# Altium project SmartPower.PrjPcb (part 2 of 2)

## Sheet [4] USB-PD Controller.SchDoc: Type-C and Sink Controller
size A3; Author: Caner ALP; Organization: ALP Electronics; Address1: Axel Oxenstiernas; Address2: Västerås; Address3: 72478; Address4: Sweden; DocumentNumber: 4; Revision: P0.1; SheetNumber: 4; SheetTotal: 7
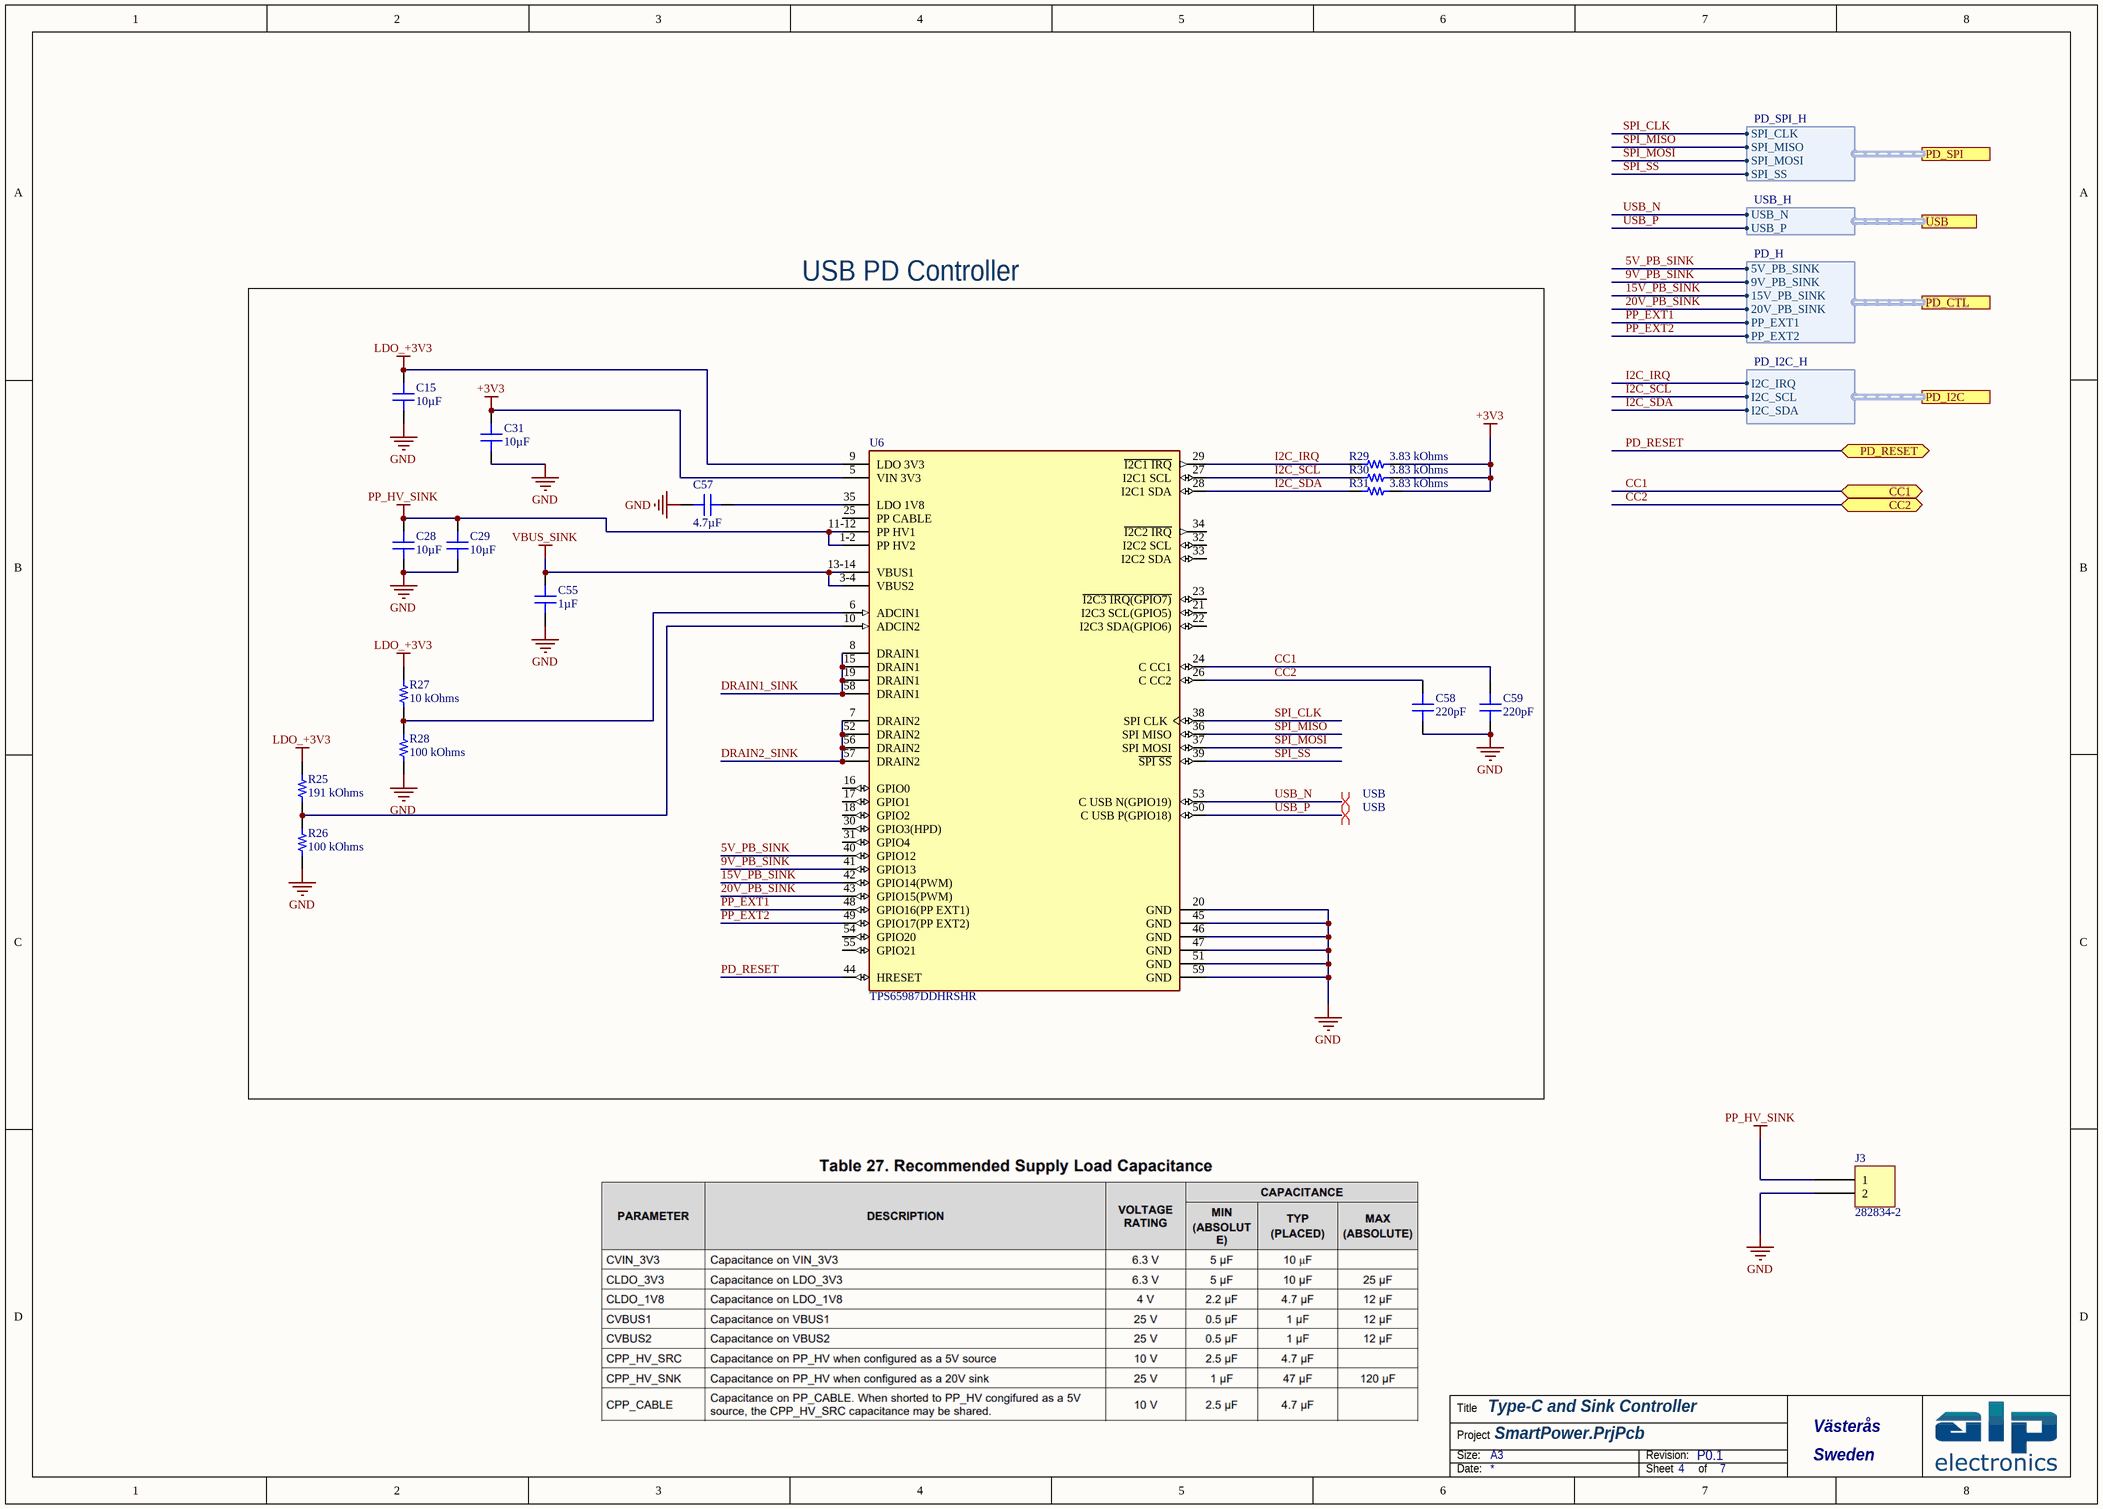
[diagram p4: [4] USB-PD Controller.SchDoc]

### Parts
C15  10µF  [CAP 0603_1608]
C28  10µF  [CAP 1206_3216 - 1.8MM]
C29  10µF  [CAP 1206_3216 - 1.8MM]
C31  10µF  [CAP 0603_1608]
C55  1µF  [CAP 1206_3216 - 0.8MM]
C57  4.7µF  [CAP 0603_1608]
C58  220pF  [CAP 0603_1608]
C59  220pF  [CAP 0603_1608]
J3  282834-2  [TE 282834-2]
R25  191 kOhms  [RES 0603_1608]
R26  100 kOhms  [RES 0603_1608]
R27  10 kOhms  [RES 0603_1608]
R28  100 kOhms  [RES 0603_1608]
R29  3.83 kOhms  [RES 0603_1608]
R30  3.83 kOhms  [RES 0603_1608]
R31  3.83 kOhms  [RES 0603_1608]
U6  TPS65987DDHRSHR  [FP-RSH0056E-MFG]

### Blocks framed on the sheet
USB PD Controller: C15 C28 C29 C31 C55 C57-C59 R25-R31 U6

### Ports
CC1 (bidir), CC2 (bidir), PD_CTL (harness PD_H), PD_I2C (harness PD_I2C_H), PD_RESET (bidir), PD_SPI (harness PD_SPI_H), USB (harness USB_H)

### Harnesses
PD_SPI_H: SPI_CLK, SPI_MISO, SPI_MOSI, SPI_SS
USB_H: USB_N, USB_P
PD_H: 5V_PB_SINK, 9V_PB_SINK, 15V_PB_SINK, 20V_PB_SINK, PP_EXT1, PP_EXT2
PD_I2C_H: I2C_IRQ, I2C_SCL, I2C_SDA

### Nets
+3V3: C31.2 R29.1 R30.1 R31.1 U6.5(VIN_3V3)
GND: C15.1 C28.1 C29.1 C31.1 C55.1 C57.2 C58.1 C59.1 J3.2 R26.1 R28.1 U6.20(GND) U6.45(GND) U6.46(GND) U6.47(GND) U6.51(GND) U6.59(GND)
LDO_+3V3: C15.2 R25.2 R27.1 U6.9(LDO_3V3)
PP_HV_SINK: C28.2 C29.2 J3.1 U6.1-2(PP_HV2) U6.11-12(PP_HV1)
VBUS_SINK: C55.2 U6.3-4(VBUS2) U6.13-14(VBUS1)
5V_PB_SINK: U6.40(GPIO12) ; port PD_CTL.5V_PB_SINK
9V_PB_SINK: U6.41(GPIO13) ; port PD_CTL.9V_PB_SINK
15V_PB_SINK: U6.42(GPIO14(PWM)) ; port PD_CTL.15V_PB_SINK
20V_PB_SINK: U6.43(GPIO15(PWM)) ; port PD_CTL.20V_PB_SINK
CC1: C59.2 U6.24(C_CC1) ; port CC1
CC2: C58.2 U6.26(C_CC2) ; port CC2
DRAIN1_SINK: U6.8(DRAIN1) U6.15(DRAIN1) U6.19(DRAIN1) U6.58(DRAIN1)
DRAIN2_SINK: U6.7(DRAIN2) U6.52(DRAIN2) U6.56(DRAIN2) U6.57(DRAIN2)
I2C_IRQ: R29.2 U6.29(~{I2C1_IRQ}) ; port PD_I2C.I2C_IRQ
I2C_SCL: R30.2 U6.27(I2C1_SCL) ; port PD_I2C.I2C_SCL
I2C_SDA: R31.2 U6.28(I2C1_SDA) ; port PD_I2C.I2C_SDA
PD_RESET: U6.44(HRESET) ; port PD_RESET
PP_EXT1: U6.48(GPIO16(PP_EXT1)) ; port PD_CTL.PP_EXT1
PP_EXT2: U6.49(GPIO17(PP_EXT2)) ; port PD_CTL.PP_EXT2
SPI_CLK: U6.38(SPI_CLK) ; port PD_SPI.SPI_CLK
SPI_MISO: U6.36(SPI_MISO) ; port PD_SPI.SPI_MISO
SPI_MOSI: U6.37(SPI_MOSI) ; port PD_SPI.SPI_MOSI
SPI_SS: U6.39(~{SPI_SS}) ; port PD_SPI.SPI_SS
USB_N: U6.53(C_USB_N(GPIO19)) ; port USB.USB_N
USB_P: U6.50(C_USB_P(GPIO18)) ; port USB.USB_P
NetC57_1: C57.1 U6.35(LDO_1V8)
NetR25_1: R25.1 R26.2 U6.10(ADCIN2)
NetR27_2: R27.2 R28.2 U6.6(ADCIN1)

Not connected (* = marked no-connect by the designer): U6 16(GPIO0) 17(GPIO1) 18(GPIO2) 21(I2C3_SCL(GPIO5)) 22(I2C3_SDA(GPIO6)) 23(~{I2C3_IRQ(GPIO7)}) 25(PP_CABLE) 30(GPIO3(HPD)) 31(GPIO4) 32(I2C2_SCL) 33(I2C2_SDA) 34(~{I2C2_IRQ}) 54(GPIO20) 55(GPIO21)

### Layout directives
differential pair; differential pair class USB: USB_N, USB_P

### Notes on the sheet
- Title
- Size:
- Project
- A3
- Revision:
- Date:
- Sheet
- of

### Library data of the parts
C15 C31 = 0603ZD106KAT2A: CAP CER 10UF 10V X5R 0603; Manufacturer: AVX Corporation; Tolerance: ±10%; Part Number: 0603ZD106KAT2A; Value: 10µF; Applications: General Purpose; Capacitance: 10µF; ComponentLink1Description: Datasheet; ComponentLink1URL: http://datasheets.avx.com/cx5r.pdf; ComponentLink2Description: DigiKey Link; ComponentLink2URL: http://digikey.com/product-detail/en/avx-corporation/0603ZD106KAT2A/478-10766-1-ND/7536554; Device Package: 0603 (1608 Metric); LastUpdated: 21/01/2020 00:02:09; Lifecycle Status: Active; Minimum Order: 1; Mounting Type: Surface Mount, MLCC; Operating Temperature: -55°C ~ 85°C; Package / Case: 0603 (1608 Metric); Packaging: TapeAndReel; PartId: 2590; Part Status: Active; Price: 0.09; Series: -; Size / Dimension: 0.063" L x 0.032" W (1.60mm x 0.81mm); Supplier 1: DigiKey; Supplier Part Number 1: 478-10766-1-ND; Temperature Coefficient: X5R; Thickness (Max): 0.037" (0.94mm); Voltage - Rated: 10V
C28 C29 = 1206BB106K250NGX072T: CAP CER 10UF 25V X7R 1206; Manufacturer: Knowles Novacap; Tolerance: ±10%; Part Number: 1206BB106K250NGX072T; Value: 10µF; Applications: General Purpose; Capacitance: 10µF; ComponentLink1Description: Datasheet; ComponentLink1URL: https://www.knowlescapacitors.com/getattachment/6c8d48ef-fc2b-4752-ae2c-ce6c208de0c4/High-Capacitance-Chip.aspx; ComponentLink2Description: DigiKey Link; ComponentLink2URL: http://digikey.com/product-detail/en/knowles-novacap/1206BB106K250NGX072T/1763-1135-1-ND/7304039; Device Package: 1206 (3216 Metric); Features: Gold Flash Termination; LastUpdated: 21/01/2020 00:03:35; Lifecycle Status: Active; Minimum Order: 1; Mounting Type: Surface Mount, MLCC; Operating Temperature: -55°C ~ 125°C; Package / Case: 1206 (3216 Metric); Packaging: TapeAndReel; PartId: 22718; Part Status: Active; Price: 1.95; Series: -; Size / Dimension: 0.125" L x 0.060" W (3.18mm x 1.52mm); Supplier 1: DigiKey; Supplier Part Number 1: 1763-1135-1-ND; Temperature Coefficient: X7R; Thickness (Max): 0.064" (1.63mm); Voltage - Rated: 25V
C55 = AC1206KKX7R8BB105: CAP CER 1UF 25V X7R 1206; Manufacturer: Yageo; Tolerance: ±10%; Part Number: AC1206KKX7R8BB105; Value: 1µF; Applications: Automotive; Capacitance: 1µF; ComponentLink1Description: Datasheet; ComponentLink1URL: http://www.yageo.com/documents/recent/UPY-AC_NP0X7R_16V-to-630V_12.pdf; ComponentLink2Description: DigiKey Link; ComponentLink2URL: http://digikey.com/product-detail/en/yageo/AC1206KKX7R8BB105/311-3039-1-ND/6643290; Device Package: 1206 (3216 Metric); LastUpdated: 21/01/2020 00:03:07; Lifecycle Status: Active; Minimum Order: 1; Mounting Type: Surface Mount, MLCC; Operating Temperature: -55°C ~ 125°C; Package / Case: 1206 (3216 Metric); Packaging: TapeAndReel; PartId: 18820; Part Status: Active; Price: 0.22; Ratings: AEC-Q200; Series: AC; Size / Dimension: 0.126" L x 0.063" W (3.20mm x 1.60mm); Supplier 1: DigiKey; Supplier Part Number 1: 311-3039-1-ND; Temperature Coefficient: X7R; Thickness (Max): 0.028" (0.70mm); Voltage - Rated: 25V
C57 = 0603ZD475KAT2A: CAP CER 4.7UF 10V X5R 0603; Manufacturer: AVX Corporation; Tolerance: ±10%; Part Number: 0603ZD475KAT2A; Value: 4.7µF; Applications: General Purpose; Capacitance: 4.7µF; ComponentLink1Description: Datasheet; ComponentLink1URL: http://datasheets.avx.com/cx5r.pdf; ComponentLink2Description: DigiKey Link; ComponentLink2URL: http://digikey.com/product-detail/en/avx-corporation/0603ZD475KAT2A/478-7943-1-ND/3881566; Device Package: 0603 (1608 Metric); LastUpdated: 21/01/2020 00:01:36; Lifecycle Status: Active; Minimum Order: 1; Mounting Type: Surface Mount, MLCC; Operating Temperature: -55°C ~ 85°C; Package / Case: 0603 (1608 Metric); PartId: 18469; Part Status: Active; Price: 0; Series: -; Size / Dimension: 0.063" L x 0.032" W (1.60mm x 0.81mm); Supplier 1: DigiKey; Supplier Part Number 1: 478-7943-1-ND; Temperature Coefficient: X5R; Thickness (Max): 0.035" (0.90mm); Voltage - Rated: 10V
C58 C59 = 500R14N221JV4T: CAP CER 220PF 50V C0G/NP0 0603; Manufacturer: Johanson Dielectrics Inc.; Temperature Coefficient: C0G, NP0; Tolerance: ±5%; Part Number: 500R14N221JV4T; Value: 220pF; Applications: General Purpose; Capacitance: 220pF; ComponentLink1Description: Datasheet; ComponentLink1URL: https://www.johansondielectrics.com/downloads/catalog/johanson-dielectrics-product-catalog.pdf; ComponentLink2Description: DigiKey Link; ComponentLink2URL: http://digikey.com/product-detail/en/johanson-dielectrics-inc/500R14N221JV4T/709-1148-1-ND/1859480; Device Package: 0603 (1608 Metric); LastUpdated: 21/01/2020 00:01:54; Lifecycle Status: Active; Minimum Order: 1; Mounting Type: Surface Mount, MLCC; Operating Temperature: -55°C ~ 125°C; Package / Case: 0603 (1608 Metric); Packaging: TapeAndReel; PartId: 11524; Part Status: Active; Price: 0.03; Series: -; Size / Dimension: 0.063" L x 0.032" W (1.60mm x 0.81mm); Supplier 1: DigiKey; Supplier Part Number 1: 709-1148-1-ND; Thickness (Max): 0.035" (0.89mm); Voltage - Rated: 50V
J3 = 282834-2: TERM BLK 2P SIDE ENT 2.54MM PCB; Manufacturer: TE Connectivity AMP Connectors; Current: 10A; Mating Orientation: Horizontal with Board; Number of Levels: 1; Pitch: 0.100" (2.54mm); Positions Per Level: 2; Voltage: 150V; Wire Gauge: 16-30 AWG; Wire Termination: Screw - Rising Cage Clamp; Part Number: 282834-2; Color: Green; ComponentLink1Description: Datasheet; ComponentLink1URL: https://www.te.com/commerce/DocumentDelivery/DDEController?Action=srchrtrv&DocNm=282834&DocType=Customer+Drawing&DocLang=English; ComponentLink2Description: DigiKey Link; ComponentLink2URL: http://digikey.com/product-detail/en/te-connectivity-amp-connectors/282834-2/A98333-ND/1150135; LastUpdated: 15/01/2020 04:15:38; Lifecycle Status: Active; Minimum Order: 1; Mounting Type: Through Hole; Packaging: Bulk; Part Status: Active; Price: 0.88; Series: Buchanan; Supplier 1: DigiKey; Supplier Part Number 1: A98333-ND
R25 = RC0603FR-07191KL: RES SMD 191K OHM 1% 1/10W 0603; Manufacturer: Yageo; Power (Watts): 0.1W, 1/10W; Temperature Coefficient: ±100ppm/°C; Part Number: RC0603FR-07191KL; Value: 191 kOhms; ComponentLink1Description: Datasheet; ComponentLink1URL: https://www.yageo.com/upload/media/product/productsearch/datasheet/rchip/PYu-RC_Group_51_RoHS_L_10.pdf; ComponentLink2Description: DigiKey Link; ComponentLink2URL: http://digikey.com/product-detail/en/yageo/RC0603FR-07191KL/311-191KHRCT-ND/729952; Composition: Thick Film; Device Package: 0603 (1608 Metric); Features: Moisture Resistant; Height - Seated (Max): 0.022" (0.55mm); LastUpdated: 21/01/2020 00:23:46; Lifecycle Status: Active; Minimum Order: 1; Number of Terminations: 2; Operating Temperature: -55°C ~ 155°C; Package / Case: 0603 (1608 Metric); Packaging: CutTape; PartId: 7764; Part Status: Active; Price: 0.10; Resistance: 191 kOhms; Series: RC; Size / Dimension: 0.063" L x 0.031" W (1.60mm x 0.80mm); Supplier 1: DigiKey; Supplier Part Number 1: 311-191KHRCT-ND; Supplier Device Package: 0603; Tolerance: ±1%
R26 R28 = CRGH0603J100K: RES SMD 100K OHM 5% 1/5W 0603; Manufacturer: TE Connectivity Passive Product; Power (Watts): 0.2W, 1/5W; Temperature Coefficient: ±100ppm/°C; Part Number: CRGH0603J100K; Value: 100 kOhms; ComponentLink1Description: Datasheet; ComponentLink1URL: https://www.te.com/commerce/DocumentDelivery/DDEController?Action=srchrtrv&DocNm=1773204-1&DocType=DS&DocLang=English; ComponentLink2Description: DigiKey Link; ComponentLink2URL: http://digikey.com/product-detail/en/te-connectivity-passive-product/CRGH0603J100K/A126393CT-ND/7603448; Composition: Thick Film; Device Package: 0603 (1608 Metric); LastUpdated: 21/01/2020 00:15:56; Lifecycle Status: Active; Minimum Order: 1; Number of Terminations: 2; Operating Temperature: -55°C ~ 155°C; Package / Case: 0603 (1608 Metric); Packaging: TapeAndReel; PartId: 24648; Part Status: Active; Price: 0.01; Resistance: 100 kOhms; Series: CRGH, Neohm; Size / Dimension: 0.063" L x 0.031" W (1.60mm x 0.80mm); Supplier 1: DigiKey; Supplier Part Number 1: A126393CT-ND; Supplier Device Package: 0603; Tolerance: ±5%
R27 = CRCW060310K0JNEA: RES SMD 10K OHM 5% 1/10W 0603; Manufacturer: Vishay Dale; Power (Watts): 0.1W, 1/10W; Temperature Coefficient: ±200ppm/°C; Part Number: CRCW060310K0JNEA; Value: 10 kOhms; ComponentLink1Description: Datasheet; ComponentLink1URL: http://www.vishay.com/docs/20035/dcrcwe3.pdf; ComponentLink2Description: DigiKey Link; ComponentLink2URL: http://digikey.com/product-detail/en/vishay-dale/CRCW060310K0JNEA/541-10KGCT-ND/1179393; Composition: Thick Film; Device Package: 0603 (1608 Metric); Features: Automotive AEC-Q200; Height - Seated (Max): 0.020" (0.50mm); LastUpdated: 21/01/2020 00:24:50; Lifecycle Status: Active; Minimum Order: 1; Number of Terminations: 2; Operating Temperature: -55°C ~ 155°C; Package / Case: 0603 (1608 Metric); Packaging: CutTape; PartId: 5216; Part Status: Active; Price: 0.10; Ratings: AEC-Q200; Resistance: 10 kOhms; Series: CRCW; Size / Dimension: 0.063" L x 0.033" W (1.60mm x 0.85mm); Supplier 1: DigiKey; Supplier Part Number 1: 541-10KGCT-ND; Supplier Device Package: 0603; Tolerance: ±5%
R29-R31 = RC0603FR-073K83L: RES SMD 3.83K OHM 1% 1/10W 0603; Manufacturer: Yageo; Power (Watts): 0.1W, 1/10W; Temperature Coefficient: ±100ppm/°C; Part Number: RC0603FR-073K83L; Value: 3.83 kOhms; ComponentLink1Description: Datasheet; ComponentLink1URL: https://www.yageo.com/upload/media/product/productsearch/datasheet/rchip/PYu-RC_Group_51_RoHS_L_10.pdf; ComponentLink2Description: DigiKey Link; ComponentLink2URL: http://digikey.com/product-detail/en/yageo/RC0603FR-073K83L/311-3.83KHRCT-ND/730082; Composition: Thick Film; Device Package: 0603 (1608 Metric); Features: Moisture Resistant; Height - Seated (Max): 0.022" (0.55mm); LastUpdated: 21/01/2020 00:21:56; Lifecycle Status: Active; Minimum Order: 1; Number of Terminations: 2; Operating Temperature: -55°C ~ 155°C; Package / Case: 0603 (1608 Metric); Packaging: CutTape; PartId: 12460; Part Status: Active; Price: 0.10; Resistance: 3.83 kOhms; Series: RC; Size / Dimension: 0.063" L x 0.031" W (1.60mm x 0.80mm); Supplier 1: DigiKey; Supplier Part Number 1: 311-3.83KHRCT-ND; Supplier Device Package: 0603; Tolerance: ±1%
U6 = CMP-04910-000002-1: ACELITE 88 ROM 1.6 PROTO 7X7; Manufacturer: Texas Instruments; Standoff Height: 0mm; Number Of Outputs: 1; Min Supply Voltage: 3.135V; Max Junction Temp: +125°C; Nominal Supply Current: 5-8mA; Max Supply Voltage: 3.45V; Output Voltage: 3.3V; Automotive: No; Manufacturer Part Number: TPS65987DDHRSHR; ComponentLink2Description: Datasheet; RoHS: TRUE; Height: 1mm; ComponentLink2URL: http://www.ti.com/lit/ds/symlink/tps65987d.pdf; Ambient Temperature Range High: +75°C; Digikey Description: ACELITE 88 ROM 1.6 PROTO 7X7; Category: IC; Octopart: https://octopart.com/tps65987ddhrshr-texas+instruments-92191376; Device Class L3: unset; Temperature Range Low: -10°C; Device Class L2: Power Management ICs; Temperature: -10°C to +75°C; Ambient Temperature Range Low: -10°C; Temperature Range High: +75°C; Lead Free: Yes; Device Class L1: Integrated Circuits (ICs); Package: RSH0056E

## Sheet [3] Power.SchDoc: Buck-Boost
size A3; Author: Caner ALP; CompanyName: ALP Electronics; DrawnBy: Caner Alp; Organization: ALP Electronics; Address1: Axel Oxenstiernas; Address2: Västerås; Address3: 72478; Address4: Sweden; DocumentNumber: 3; SheetNumber: 3; SheetTotal: 7
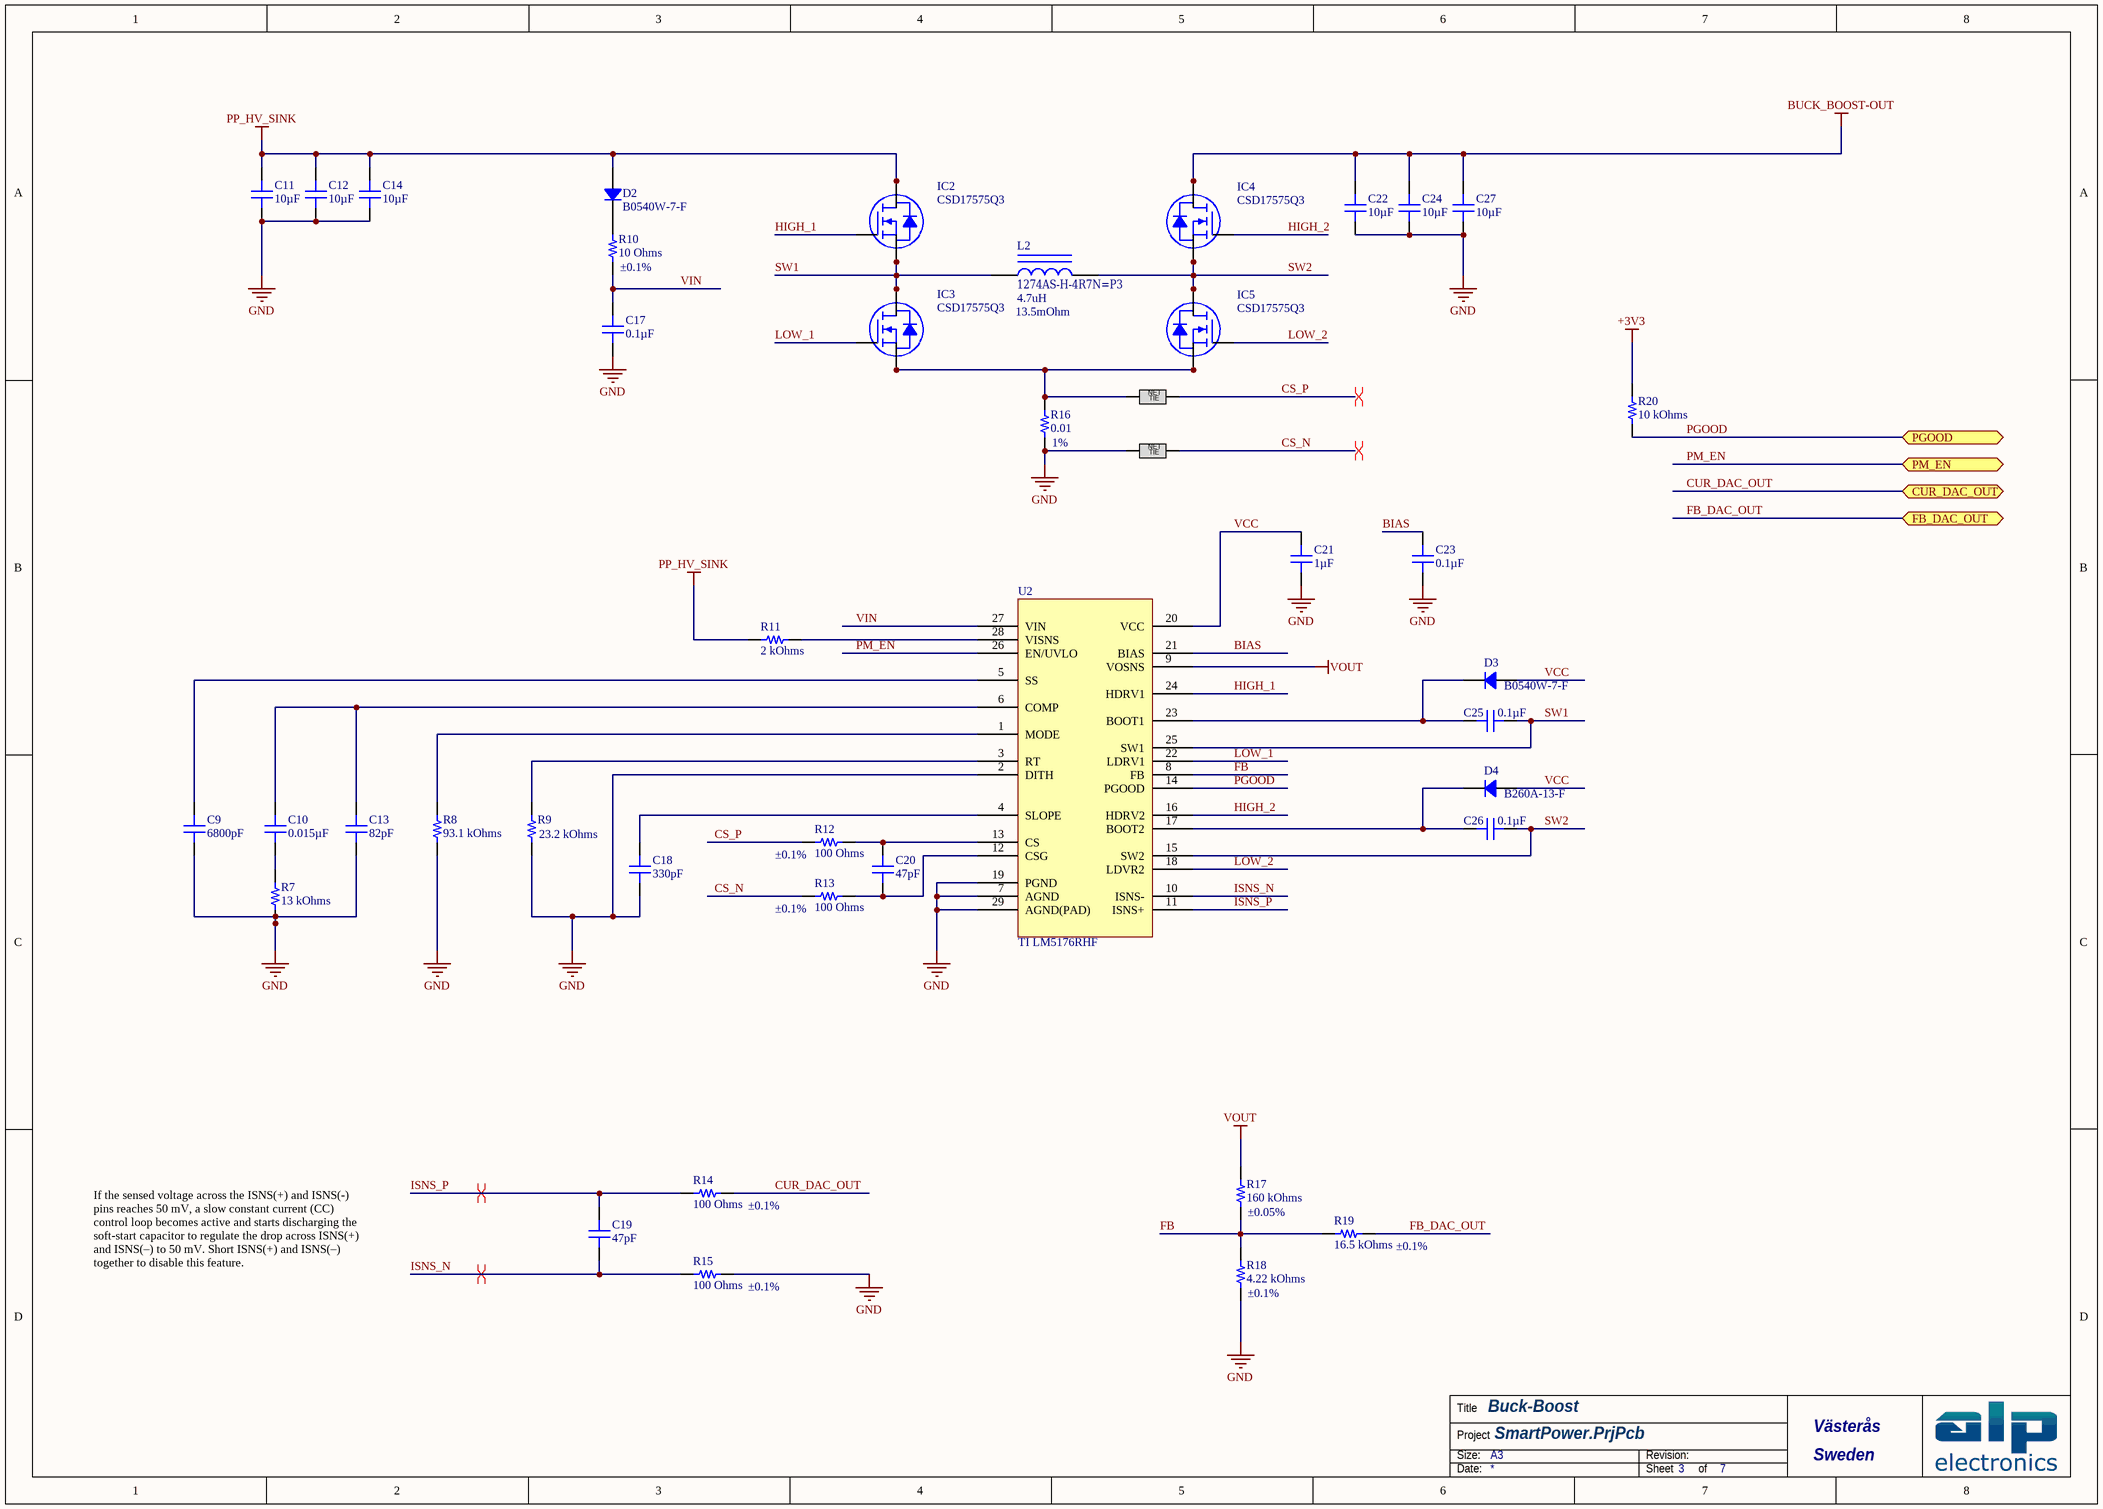
[diagram p5: [3] Power.SchDoc]

### Parts
C9  6800pF  [CAP 0603_1608]
C10  0.015µF  [CAP 0603_1608]
C11  10µF  [CAP 2220_5650 2.5MM]
C12  10µF  [CAP 2220_5650 2.5MM]
C13  82pF  [CAP 0603_1608]
C14  10µF  [CAP 2220_5650 2.5MM]
C17  0.1µF  [CAP 0603_1608]
C18  330pF  [CAP 0603_1608]
C19  47pF  [CAP 0603_1608]
C20  47pF  [CAP 0603_1608]
C21  1µF  [CAP 0603_1608]
C22  10µF  [CAP 2220_5650 2.5MM]
C23  0.1µF  [CAP 0603_1608]
C24  10µF  [CAP 2220_5650 2.5MM]
C25  0.1µF  [CAP 0603_1608]
C26  0.1µF  [CAP 0603_1608]
C27  10µF  [CAP 2220_5650 2.5MM]
D2  B0540W-7-F  [SOD-123]
D3  B0540W-7-F  [SOD-123]
D4  B260A-13-F  [DO214AC SMA]
IC2  CSD17575Q3  [TI SON-8 Q3]
IC3  CSD17575Q3  [TI SON-8 Q3]
IC4  CSD17575Q3  [TI SON-8 Q3]
IC5  CSD17575Q3  [TI SON-8 Q3]
L2  ‎1274AS-H-4R7N=P3‎  value 4.7uH  DCR: 13.5mOhm  [MURATA 1274AS]
NetTie1  Net Tie  [Net_Tie_2x0.156mm]  (value not drawn)  (net tie, no BOM)
NetTie2  Net Tie  [Net_Tie_2x0.156mm]  (value not drawn)  (net tie, no BOM)
R7  13 kOhms  [RES 0603_1608]
R8  93.1 kOhms  [RES 0603_1608]
R9  23.2 kOhms  [RES 0603_1608]
R10  Tolerance: ±0.1%  [RES 0603_1608]  (hidden comment: 10 Ohms)
R11  2 kOhms  [RES 0603_1608]
R12  Tolerance: ±0.1%  [RES 0603_1608]  (hidden comment: 100 Ohms)
R13  Tolerance: ±0.1%  [RES 0603_1608]  (hidden comment: 100 Ohms)
R14  Tolerance: ±0.1%  [RES 0603_1608]  (hidden comment: 100 Ohms)
R15  Tolerance: ±0.1%  [RES 0603_1608]  (hidden comment: 100 Ohms)
R16  0.01  Tolerance: 1%  [STACKPOLE CSR2512]
R17  Tolerance: ±0.05%  [RES 0603_1608]  (hidden comment: 160 kOhms)
R18  Tolerance: ±0.1%  [RES 0603_1608]  (hidden comment: 4.22 kOhms)
R19  Tolerance: ±0.1%  [RES 0603_1608]  (hidden comment: 16.5 kOhms)
R20  10 kOhms  [RES 0603_1608]
U2  TI LM5176RHF  [TI VQFN-28 RHF]

### Ports
CUR_DAC_OUT (bidir), FB_DAC_OUT (bidir), PGOOD (bidir), PM_EN (bidir)

### Nets
+3V3: R20.1
BUCK_BOOST-OUT: C22.2 C24.2 C27.2 IC4.5(D) IC4.6(D) IC4.7(D) IC4.8(D)
GND: C9.1 C11.1 C12.1 C13.1 C14.1 C17.2 C18.1 C21.1 C22.1 C23.1 C24.1 C27.1 NetTie2.1 R7.1 R8.1 R9.1 R15.2 R16.1 R18.1 U2.2(DITH) U2.7(AGND) U2.19(PGND) U2.29(AGND(PAD))
PP_HV_SINK: C11.2 C12.2 C14.2 D2.1 IC2.5(D) IC2.6(D) IC2.7(D) IC2.8(D) R11.1
VOUT: R17.2 U2.9(VOSNS)
BIAS: C23.2 U2.21(BIAS)
CS_N: NetTie2.2 R13.1
CS_P: NetTie1.2 R12.1
CUR_DAC_OUT: R14.2 ; port CUR_DAC_OUT
FB: R17.1 R18.2 R19.1 U2.8(FB)
FB_DAC_OUT: R19.2 ; port FB_DAC_OUT
HIGH_1: IC2.4(G) U2.24(HDRV1)
HIGH_2: IC4.4(G) U2.16(HDRV2)
ISNS_N: C19.1 R15.1 U2.10(ISNS-)
ISNS_P: C19.2 R14.1 U2.11(ISNS+)
LOW_1: IC3.4(G) U2.22(LDRV1)
LOW_2: IC5.4(G) U2.18(LDVR2)
PGOOD: R20.2 U2.14(PGOOD) ; port PGOOD
PM_EN: U2.26(EN/UVLO) ; port PM_EN
SW1: C25.1 IC2.1(S) IC2.2(S) IC2.3(S) IC3.5(D) IC3.6(D) IC3.7(D) IC3.8(D) L2.1 U2.25(SW1)
SW2: C26.1 IC4.1(S) IC4.2(S) IC4.3(S) IC5.5(D) IC5.6(D) IC5.7(D) IC5.8(D) L2.2 U2.15(SW2)
VCC: C21.2 D3.1 D4.1 U2.20(VCC)
VIN: C17.1 R10.1 U2.27(VIN)
NetC9_2: C9.2 U2.5(SS)
NetC10_1: C10.1 R7.2
NetC10_2: C10.2 C13.2 U2.6(COMP)
NetC18_2: C18.2 U2.4(SLOPE)
NetC20_1: C20.1 R13.2 U2.12(CSG)
NetC20_2: C20.2 R12.2 U2.13(CS)
NetC25_2: C25.2 D3.2 U2.23(BOOT1)
NetC26_2: C26.2 D4.2 U2.17(BOOT2)
NetD2_2: D2.2 R10.2
NetIC3_1: IC3.1(S) IC3.2(S) IC3.3(S) IC5.1(S) IC5.2(S) IC5.3(S) NetTie1.1 R16.2
NetR8_2: R8.2 U2.1(MODE)
NetR9_2: R9.2 U2.3(RT)
NetR11_2: R11.2 U2.28(VISNS)

### Layout directives
differential pair: CS_N, CS_P, ISNS_N, ISNS_P

### Notes on the sheet
- If the sensed voltage across the ISNS(+) and ISNS(-) pins reaches 50 mV, a slow constant current (CC) control loop becomes active and starts discharging the soft-start capacitor to regulate the drop across ISNS(+) and ISNS(–) to 50 mV. Short ISNS(+) and ISNS(–) together to disable this feature.
- Title
- Size:
- Project
- A3
- Revision:
- Date:
- Sheet
- of
- (in symbol Net Tie) NET; TIE

### Library data of the parts
C9 = 0603B682K500CT: CAP CER 6800PF 50V X7R 0603; Manufacturer: Walsin Technology Corporation; Tolerance: ±10%; Part Number: 0603B682K500CT; Value: 6800pF; Applications: General Purpose; Capacitance: 6800pF; ComponentLink1Description: Datasheet; ComponentLink1URL: http://www.passivecomponent.com/wp-content/uploads/2018/10/MLCC.pdf; ComponentLink2Description: DigiKey Link; ComponentLink2URL: http://digikey.com/product-detail/en/walsin-technology-corporation/0603B682K500CT/1292-1459-1-ND/9355463; Device Package: 0603 (1608 Metric); LastUpdated: 21/01/2020 00:01:43; Lifecycle Status: Active; Minimum Order: 1; Mounting Type: Surface Mount, MLCC; Operating Temperature: -55°C ~ 125°C; Package / Case: 0603 (1608 Metric); Packaging: TapeAndReel; PartId: 16042; Part Status: Active; Price: 0.01; Series: -; Size / Dimension: 0.063" L x 0.031" W (1.60mm x 0.80mm); Supplier 1: DigiKey; Supplier Part Number 1: 1292-1459-1-ND; Temperature Coefficient: X7R; Thickness (Max): 0.034" (0.87mm); Voltage - Rated: 50V
C10 = 0603B153K500CT: CAP CER 0.015UF 50V X7R 0603; Manufacturer: Walsin Technology Corporation; Tolerance: ±10%; Part Number: 0603B153K500CT; Value: 0.015µF; Applications: General Purpose; Capacitance: 0.015µF; ComponentLink1Description: Datasheet; ComponentLink1URL: http://www.passivecomponent.com/wp-content/uploads/2018/10/MLCC.pdf; ComponentLink2Description: DigiKey Link; ComponentLink2URL: http://digikey.com/product-detail/en/walsin-technology-corporation/0603B153K500CT/1292-1402-1-ND/9355406; Device Package: 0603 (1608 Metric); LastUpdated: 21/01/2020 00:01:57; Lifecycle Status: Active; Minimum Order: 1; Mounting Type: Surface Mount, MLCC; Operating Temperature: -55°C ~ 125°C; Package / Case: 0603 (1608 Metric); Packaging: TapeAndReel; PartId: 10009; Part Status: Active; Price: 0.01; Series: -; Size / Dimension: 0.063" L x 0.031" W (1.60mm x 0.80mm); Supplier 1: DigiKey; Supplier Part Number 1: 1292-1402-1-ND; Temperature Coefficient: X7R; Thickness (Max): 0.034" (0.87mm); Voltage - Rated: 50V
C11 C12 C14 C22 C24 C27 = C5750X7R1H106M230KB: CAP CER 10UF 50V X7R 2220; Manufacturer: TDK Corporation; Tolerance: ±20%; Part Number: C5750X7R1H106M230KB; Value: 10µF; Applications: General Purpose; Capacitance: 10µF; ComponentLink1Description: Datasheet; ComponentLink1URL: https://product.tdk.com/info/en/catalog/datasheets/mlcc_commercial_general_en.pdf?ref_disty=digikey; ComponentLink2Description: DigiKey Link; ComponentLink2URL: http://digikey.com/product-detail/en/tdk-corporation/C5750X7R1H106M230KB/445-1454-1-ND/569120; Device Package: 2220 (5750 Metric); LastUpdated: 21/01/2020 00:34:55; Lifecycle Status: Active; Minimum Order: 1; Mounting Type: Surface Mount, MLCC; Operating Temperature: -55°C ~ 125°C; Package / Case: 2220 (5750 Metric); Packaging: TapeAndReel; Part Status: Active; Price: 0.85; Series: C; Size / Dimension: 0.224" L x 0.197" W (5.70mm x 5.00mm); Supplier 1: DigiKey; Supplier Part Number 1: 445-1454-1-ND; Temperature Coefficient: X7R; Thickness (Max): 0.098" (2.50mm); Voltage - Rated: 50V
C13 = 06031A820GAT2A: CAP CER 82PF 100V C0G/NP0 0603; Manufacturer: AVX Corporation; Temperature Coefficient: C0G, NP0; Tolerance: ±2%; Part Number: 06031A820GAT2A; Value: 82pF; Applications: General Purpose; Capacitance: 82pF; ComponentLink1Description: Datasheet; ComponentLink1URL: http://datasheets.avx.com/C0GNP0-Dielectric.pdf; ComponentLink2Description: DigiKey Link; ComponentLink2URL: http://digikey.com/product-detail/en/avx-corporation/06031A820GAT2A/478-10796-1-ND/7536341; Device Package: 0603 (1608 Metric); LastUpdated: 21/01/2020 00:01:52; Lifecycle Status: Active; Minimum Order: 1; Mounting Type: Surface Mount, MLCC; Operating Temperature: -55°C ~ 125°C; Package / Case: 0603 (1608 Metric); Packaging: TapeAndReel; PartId: 13264; Part Status: Active; Price: 0.09; Series: -; Size / Dimension: 0.063" L x 0.032" W (1.60mm x 0.81mm); Supplier 1: DigiKey; Supplier Part Number 1: 478-10796-1-ND; Thickness (Max): 0.035" (0.90mm); Voltage - Rated: 100V
C17 C23 C25 C26 = 0603BB104K500NGT: CAP CER 0.1UF 50V X7R 0603; Manufacturer: Knowles Novacap; Tolerance: ±10%; Part Number: 0603BB104K500NGT; Value: 0.1µF; Applications: General Purpose; Capacitance: 0.1µF; ComponentLink1Description: Datasheet; ComponentLink1URL: https://www.knowlescapacitors.com/getattachment/6c8d48ef-fc2b-4752-ae2c-ce6c208de0c4/High-Capacitance-Chip.aspx; ComponentLink2Description: DigiKey Link; ComponentLink2URL: http://digikey.com/product-detail/en/knowles-novacap/0603BB104K500NGT/1763-1146-1-ND/7304094; Device Package: 0603 (1608 Metric); Features: Gold Flash Termination; LastUpdated: 21/01/2020 00:02:02; Lifecycle Status: Active; Minimum Order: 1; Mounting Type: Surface Mount, MLCC; Operating Temperature: -55°C ~ 125°C; Package / Case: 0603 (1608 Metric); Packaging: TapeAndReel; PartId: 7006; Part Status: Active; Price: 0.56; Series: -; Size / Dimension: 0.060" L x 0.030" W (1.52mm x 0.76mm); Supplier 1: DigiKey; Supplier Part Number 1: 1763-1146-1-ND; Temperature Coefficient: X7R; Thickness (Max): 0.035" (0.89mm); Voltage - Rated: 50V
C18 = 0603N331J101CT: CAP CER 330PF 100V C0G/NP0 0603; Manufacturer: Walsin Technology Corporation; Temperature Coefficient: C0G, NP0; Tolerance: ±5%; Part Number: 0603N331J101CT; Value: 330pF; Applications: General Purpose; Capacitance: 330pF; ComponentLink1Description: Datasheet; ComponentLink1URL: http://www.passivecomponent.com/wp-content/uploads/2018/10/MLCC.pdf; ComponentLink2Description: DigiKey Link; ComponentLink2URL: http://digikey.com/product-detail/en/walsin-technology-corporation/0603N331J101CT/1292-1519-1-ND/9355523; Device Package: 0603 (1608 Metric); LastUpdated: 21/01/2020 00:01:44; Lifecycle Status: Active; Minimum Order: 1; Mounting Type: Surface Mount, MLCC; Operating Temperature: -55°C ~ 125°C; Package / Case: 0603 (1608 Metric); Packaging: TapeAndReel; PartId: 15517; Part Status: Active; Price: 0.01; Series: -; Size / Dimension: 0.063" L x 0.031" W (1.60mm x 0.80mm); Supplier 1: DigiKey; Supplier Part Number 1: 1292-1519-1-ND; Thickness (Max): 0.034" (0.87mm); Voltage - Rated: 100V
C19 C20 = 500X14N470MV4T: CAP CER 47PF 50V C0G/NP0 0603; Manufacturer: Johanson Dielectrics Inc.; Temperature Coefficient: C0G, NP0; Tolerance: ±20%; Part Number: 500X14N470MV4T; Value: 47pF; Applications: Bypass, Decoupling; Capacitance: 47pF; ComponentLink1Description: Datasheet; ComponentLink1URL: https://www.johansondielectrics.com/downloads/x2y-filter-and-decoupling-capacitors.pdf; ComponentLink2Description: DigiKey Link; ComponentLink2URL: http://digikey.com/product-detail/en/johanson-dielectrics-inc/500X14N470MV4T/709-1003-1-ND/1556408; Device Package: 0603 (1608 Metric); Features: Low ESL (X2Y); LastUpdated: 21/01/2020 00:02:07; Lifecycle Status: Active; Minimum Order: 1; Mounting Type: Surface Mount, MLCC; Operating Temperature: -55°C ~ 125°C; Package / Case: 0603 (1608 Metric); Packaging: TapeAndReel; PartId: 4173; Part Status: Active; Price: 0.08; Series: X2Y®; Size / Dimension: 0.064" L x 0.035" W (1.63mm x 0.89mm); Supplier 1: DigiKey; Supplier Part Number 1: 709-1003-1-ND; Thickness (Max): 0.026" (0.66mm); Voltage - Rated: 50V
C21 = 06035C105KAT2A: CAP CER 1UF 50V X7R 0603; Manufacturer: AVX Corporation; Tolerance: ±10%; Part Number: 06035C105KAT2A; Value: 1µF; Applications: General Purpose; Capacitance: 1µF; ComponentLink1Description: Datasheet; ComponentLink1URL: http://datasheets.avx.com/X7RDielectric.pdf; ComponentLink2Description: DigiKey Link; ComponentLink2URL: http://digikey.com/product-detail/en/avx-corporation/06035C105KAT2A/478-10073-1-ND/6564295; Device Package: 0603 (1608 Metric); LastUpdated: 21/01/2020 00:02:08; Lifecycle Status: Active; Minimum Order: 1; Mounting Type: Surface Mount, MLCC; Operating Temperature: -55°C ~ 125°C; Package / Case: 0603 (1608 Metric); Packaging: TapeAndReel; PartId: 2905; Part Status: Active; Price: 0.15; Series: -; Size / Dimension: 0.063" L x 0.032" W (1.60mm x 0.81mm); Supplier 1: DigiKey; Supplier Part Number 1: 478-10073-1-ND; Temperature Coefficient: X7R; Thickness (Max): 0.020" (0.50mm); Voltage - Rated: 50V
D2 D3 = B0540W-7-F: DIODE SCHOTTKY 40V 500MA SOD123; Manufacturer: Diodes Incorporated; Current Reverse Leakage @ Vr: 20uA @ 40V; Voltage Forward (Vf): 510mV @ 500mA; Part Number: B0540W-7-F; PartId: 14601; Supplier 1: Digi-Key; Supplier Part Number 1: B0540W-FDITR-ND; ComponentLink1Description: Datasheet; ComponentLink1URL: http://www.diodes.com/_files/datasheets/ds30138.pdf; ComponentLink2Description: Digi-Key Listing; ComponentLink2URL: https://www.digikey.com/product-detail/en/diodes-incorporated/B0540W-7-F/B0540W-FDITR-ND/717688; Junction Operating Temperature: -65C ~ 150C; Price: 0.0644; Type: Schottky; Device Package: SOD-123; Voltage DC Reverse (Vr): 40V; Current Rectified: 500mA
D4 = B260A-13-F: DIODE SCHOTTKY 60V 2A SMA; Manufacturer: Diodes Incorporated; Current Reverse Leakage @ Vr: 500uA @ 60V; Voltage Forward (Vf): 700mV @ 2A; Part Number: B260A-13-F; PartId: 16325; Supplier 1: Digi-Key; Supplier Part Number 1: B260A-FDITR-ND; ComponentLink1Description: Datasheet; ComponentLink1URL: http://www.diodes.com/_files/datasheets/ds13004.pdf; ComponentLink2Description: Digi-Key Listing; ComponentLink2URL: https://www.digikey.com/product-detail/en/diodes-incorporated/B260A-13-F/B260A-FDITR-ND/750837; Junction Operating Temperature: -65C ~ 150C; Price: 0.0884; Type: Schottky; Device Package: DO-214AC, SMA; Voltage DC Reverse (Vr): 60V; Current Rectified: 2A
IC2-IC5 = CSD17308Q3T: MOSFET N-CH 30V 50A; Manufacturer: Texas Instruments; Rds On (Max) at Id, Vgs: 10.3 mOhm @ 10A, 8V; Vgs(th) (Max) at Id: 1.8V @ 250uA; Gate Charge (Qg): 5.1nC @ 4.5V; Input Capacitance (Ciss) at Vds: 700pF @ 15V; Power - Max: 2.7W; Current Continuous Drain: 50A (Ta), 44A (Tc); Part Number: CSD17308Q3T; PartId: 18050; Supplier 1: Digi-Key; Supplier Part Number 1: 296-44075-2-ND; ComponentLink1Description: Datasheet; ComponentLink1URL: http://www.ti.com/lit/ds/symlink/csd17308q3.pdf; ComponentLink2Description: Digi-Key Listing; ComponentLink2URL: https://www.digikey.com/product-detail/en/texas-instruments/CSD17308Q3T/296-44075-2-ND/5985436; Price: 0.8314; Type: MOSFET N-Channel, Metal Oxide; Device Package: 8-PowerTDFN; Drain to Source Voltage (Vdss): 30V; Features: Standard
L2 = Inductor Iron: Magnetic-Core Inductor; Published: 24-Mar-1999; LatestRevisionDate: 17-Jul-2002; LatestRevisionNote: Re-released for DXP Platform.; PackageReference: AXIAL-0.9; Publisher: Altium Limited; PackageDescription: Axial Device, Thru-Hole; 2 Leads; 0.9 in Pin Spacing
R7 = ERJ-PB3D1302V: RES SMD 13K OHM 0.5% 1/5W 0603; Manufacturer: Panasonic Electronic Components; Power (Watts): 0.2W, 1/5W; Temperature Coefficient: ±50ppm/°C; Part Number: ERJ-PB3D1302V; Value: 13 kOhms; ComponentLink1Description: Datasheet; ComponentLink1URL: https://industrial.panasonic.com/cdbs/www-data/pdf/RDM0000/AOA0000C328.pdf; ComponentLink2Description: DigiKey Link; ComponentLink2URL: http://digikey.com/product-detail/en/panasonic-electronic-components/ERJ-PB3D1302V/P20409CT-ND/6214664; Composition: Thick Film; Device Package: 0603 (1608 Metric); Features: Automotive AEC-Q200, Pulse Withstanding; Height - Seated (Max): 0.022" (0.55mm); LastUpdated: 21/01/2020 00:18:56; Lifecycle Status: Active; Minimum Order: 1; Number of Terminations: 2; Operating Temperature: -55°C ~ 155°C; Package / Case: 0603 (1608 Metric); Packaging: TapeAndReel; PartId: 19636; Part Status: Active; Price: 0.02; Ratings: AEC-Q200; Resistance: 13 kOhms; Series: ERJ; Size / Dimension: 0.063" L x 0.031" W (1.60mm x 0.80mm); Supplier 1: DigiKey; Supplier Part Number 1: P20409CT-ND; Supplier Device Package: 0603; Tolerance: ±0.5%
R8 = ERJ-PB3D9312V: RES SMD 93.1K OHM 0.5% 1/5W 0603; Manufacturer: Panasonic Electronic Components; Power (Watts): 0.2W, 1/5W; Temperature Coefficient: ±50ppm/°C; Part Number: ERJ-PB3D9312V; Value: 93.1 kOhms; ComponentLink1Description: Datasheet; ComponentLink1URL: https://industrial.panasonic.com/cdbs/www-data/pdf/RDM0000/AOA0000C328.pdf; ComponentLink2Description: DigiKey Link; ComponentLink2URL: http://digikey.com/product-detail/en/panasonic-electronic-components/ERJ-PB3D9312V/P20508CT-ND/6214763; Composition: Thick Film; Device Package: 0603 (1608 Metric); Features: Automotive AEC-Q200, Pulse Withstanding; Height - Seated (Max): 0.022" (0.55mm); LastUpdated: 21/01/2020 00:24:15; Lifecycle Status: Active; Minimum Order: 1; Number of Terminations: 2; Operating Temperature: -55°C ~ 155°C; Package / Case: 0603 (1608 Metric); Packaging: TapeAndReel; PartId: 6686; Part Status: Active; Price: 0.02; Ratings: AEC-Q200; Resistance: 93.1 kOhms; Series: ERJ; Size / Dimension: 0.063" L x 0.031" W (1.60mm x 0.80mm); Supplier 1: DigiKey; Supplier Part Number 1: P20508CT-ND; Supplier Device Package: 0603; Tolerance: ±0.5%
R9 = RNCF0603DTE23K2: RES 23.2K OHM 0.5% 1/10W 0603; Manufacturer: Stackpole Electronics Inc; Power (Watts): 0.1W, 1/10W; Temperature Coefficient: ±25ppm/°C; Part Number: RNCF0603DTE23K2; Value: 23.2 kOhms; ComponentLink1Description: Datasheet; ComponentLink1URL: https://www.seielect.com/catalog/sei-rncf.pdf; ComponentLink2Description: DigiKey Link; ComponentLink2URL: http://digikey.com/product-detail/en/stackpole-electronics-inc/RNCF0603DTE23K2/RNCF0603DTE23K2CT-ND/9915119; Composition: Thin Film; Device Package: 0603 (1608 Metric); Features: Automotive AEC-Q200; Height - Seated (Max): 0.022" (0.55mm); LastUpdated: 21/01/2020 00:24:44; Lifecycle Status: Active; Minimum Order: 1; Number of Terminations: 2; Operating Temperature: -55°C ~ 155°C; Package / Case: 0603 (1608 Metric); Packaging: TapeAndReel; PartId: 5426; Part Status: Active; Price: 0.02; Ratings: AEC-Q200; Resistance: 23.2 kOhms; Series: RNCF; Size / Dimension: 0.061" L x 0.031" W (1.55mm x 0.80mm); Supplier 1: DigiKey; Supplier Part Number 1: RNCF0603DTE23K2CT-ND; Supplier Device Package: 0603; Tolerance: ±0.5%
R10 = RT0603BRD0710RL: RES SMD 10 OHM 0.1% 1/10W 0603; Manufacturer: Yageo; Power (Watts): 0.1W, 1/10W; Temperature Coefficient: ±25ppm/°C; Part Number: RT0603BRD0710RL; Value: 10 Ohms; ComponentLink1Description: Datasheet; ComponentLink1URL: https://www.yageo.com/upload/media/product/productsearch/datasheet/rchip/PYu-RT_1-to-0.01_RoHS_L_11.pdf; ComponentLink2Description: DigiKey Link; ComponentLink2URL: http://digikey.com/product-detail/en/yageo/RT0603BRD0710RL/YAG3350CT-ND/5418055; Composition: Thin Film; Device Package: 0603 (1608 Metric); Height - Seated (Max): 0.022" (0.55mm); LastUpdated: 21/01/2020 00:22:54; Lifecycle Status: Active; Minimum Order: 1; Number of Terminations: 2; Operating Temperature: -55°C ~ 155°C; Package / Case: 0603 (1608 Metric); Packaging: TapeAndReel; PartId: 10161; Part Status: Active; Price: 0.05; Resistance: 10 Ohms; Series: RT; Size / Dimension: 0.063" L x 0.031" W (1.60mm x 0.80mm); Supplier 1: DigiKey; Supplier Part Number 1: YAG3350CT-ND; Supplier Device Package: 0603
R11 = CR0603-JW-202ELF: RES SMD 2K OHM 5% 1/10W 0603; Manufacturer: Bourns Inc.; Power (Watts): 0.1W, 1/10W; Temperature Coefficient: ±200ppm/°C; Part Number: CR0603-JW-202ELF; Value: 2 kOhms; ComponentLink1Description: Datasheet; ComponentLink1URL: https://www.bourns.com/docs/Product-Datasheets/CHPREZTR.pdf; ComponentLink2Description: DigiKey Link; ComponentLink2URL: http://digikey.com/product-detail/en/bourns-inc/CR0603-JW-202ELF/CR0603-JW-202ELFCT-ND/3925347; Composition: Thick Film; Device Package: 0603 (1608 Metric); Features: Moisture Resistant; Height - Seated (Max): 0.022" (0.55mm); LastUpdated: 21/01/2020 00:24:32; Lifecycle Status: Active; Minimum Order: 1; Number of Terminations: 2; Operating Temperature: -55°C ~ 155°C; Package / Case: 0603 (1608 Metric); Packaging: CutTape; PartId: 5980; Part Status: Active; Price: 0.10; Resistance: 2 kOhms; Series: CR0603; Size / Dimension: 0.063" L x 0.031" W (1.60mm x 0.80mm); Supplier 1: DigiKey; Supplier Part Number 1: CR0603-JW-202ELFCT-ND; Supplier Device Package: 0603; Tolerance: ±5%
R12-R15 = RNCS0603BKE100R: RES 100 OHM 0.1% 1/16W 0603; Manufacturer: Stackpole Electronics Inc; Power (Watts): 0.063W, 1/16W; Temperature Coefficient: ±25ppm/°C; Part Number: RNCS0603BKE100R; Value: 100 Ohms; ComponentLink1Description: Datasheet; ComponentLink1URL: https://www.seielect.com/catalog/sei-rncs_rnch.pdf; ComponentLink2Description: DigiKey Link; ComponentLink2URL: http://digikey.com/product-detail/en/stackpole-electronics-inc/RNCS0603BKE100R/RNCS0603BKE100RCT-ND/1800117; Composition: Thin Film; Device Package: 0603 (1608 Metric); Features: Anti-Corrosive, Automotive AEC-Q200, Moisture Resistant; Height - Seated (Max): 0.022" (0.55mm); LastUpdated: 21/01/2020 00:25:01; Lifecycle Status: Active; Minimum Order: 1; Number of Terminations: 2; Operating Temperature: -55°C ~ 155°C; Package / Case: 0603 (1608 Metric); Packaging: TapeAndReel; PartId: 4839; Part Status: Active; Price: 0.08; Ratings: AEC-Q200; Resistance: 100 Ohms; Series: RNCS; Size / Dimension: 0.061" L x 0.031" W (1.55mm x 0.80mm); Supplier 1: DigiKey; Supplier Part Number 1: RNCS0603BKE100RCT-ND; Supplier Device Package: 0603
R16 = CSR2512FK10L0: RES SMD 0.01 OHM 1% 2W 2512; Manufacturer: Stackpole Electronics Inc.; TemperatureRange: -55C ~ 155C; TemperatureCoefficient: 200ppm/C; Value: 0.01; Part Number: CSR2512FK10L0; PartId: 10090; Supplier 1: Digi-Key; Supplier Part Number 1: CSR2512FK10L0-ND; ComponentLink1Description: Datasheet; ComponentLink1URL: http://www.seielect.com/catalog/SEI-CSR_CSRN.pdf; ComponentLink2Description: Digi-Key Listing; ComponentLink2URL: https://www.digikey.com/product-detail/en/stackpole-electronics-inc/CSR2512FK10L0/CSR2512FK10L0-ND/1742503; PowerRating: 2W; Price: 0.22; Device Package: 2512 (6432 Metric)
R17 = RG1608N-164-W-T1: RES SMD 160KOHM 0.05% 1/10W 0603; Manufacturer: Susumu; Power (Watts): 0.1W, 1/10W; Temperature Coefficient: ±10ppm/°C; Part Number: RG1608N-164-W-T1; Value: 160 kOhms; ComponentLink1Description: Datasheet; ComponentLink1URL: //media.digikey.com/pdf/Data%20Sheets/Susumu%20PDFs/RG_RM_RGH_Oct2012.pdf; ComponentLink2Description: DigiKey Link; ComponentLink2URL: http://digikey.com/product-detail/en/susumu/RG1608N-164-W-T1/408-1681-1-ND/600838; Composition: Thin Film; Device Package: 0603 (1608 Metric); Features: Anti-Sulfur, Automotive AEC-Q200; Height - Seated (Max): 0.020" (0.50mm); LastUpdated: 21/01/2020 00:21:03; Lifecycle Status: Active; Minimum Order: 1; Number of Terminations: 2; Operating Temperature: -55°C ~ 155°C; Package / Case: 0603 (1608 Metric); Packaging: TapeAndReel; PartId: 14646; Part Status: Active; Price: 0.30; Ratings: AEC-Q200; Resistance: 160 kOhms; Series: RG; Size / Dimension: 0.063" L x 0.031" W (1.60mm x 0.80mm); Supplier 1: DigiKey; Supplier Part Number 1: 408-1681-1-ND; Supplier Device Package: 0603
R18 = ERJ-PB3B4221V: RES SMD 4.22K OHM 0.1% 1/5W 0603; Manufacturer: Panasonic Electronic Components; Power (Watts): 0.2W, 1/5W; Temperature Coefficient: ±50ppm/°C; Part Number: ERJ-PB3B4221V; Value: 4.22 kOhms; ComponentLink1Description: Datasheet; ComponentLink1URL: https://industrial.panasonic.com/cdbs/www-data/pdf/RDM0000/AOA0000C328.pdf; ComponentLink2Description: DigiKey Link; ComponentLink2URL: http://digikey.com/product-detail/en/panasonic-electronic-components/ERJ-PB3B4221V/P20042CT-ND/6214297; Composition: Thick Film; Device Package: 0603 (1608 Metric); Features: Automotive AEC-Q200, Pulse Withstanding; Height - Seated (Max): 0.022" (0.55mm); LastUpdated: 21/01/2020 00:23:17; Lifecycle Status: Active; Minimum Order: 1; Number of Terminations: 2; Operating Temperature: -55°C ~ 155°C; Package / Case: 0603 (1608 Metric); Packaging: TapeAndReel; PartId: 9111; Part Status: Active; Price: 0.03; Ratings: AEC-Q200; Resistance: 4.22 kOhms; Series: ERJ; Size / Dimension: 0.063" L x 0.031" W (1.60mm x 0.80mm); Supplier 1: DigiKey; Supplier Part Number 1: P20042CT-ND; Supplier Device Package: 0603
R19 = ERA-3AEB1652V: RES SMD 16.5KOHM 0.1% 1/10W 0603; Manufacturer: Panasonic Electronic Components; Power (Watts): 0.1W, 1/10W; Temperature Coefficient: ±25ppm/°C; Part Number: ERA-3AEB1652V; Value: 16.5 kOhms; ComponentLink1Description: Datasheet; ComponentLink1URL: https://industrial.panasonic.com/cdbs/www-data/pdf/RDM0000/AOA0000C307.pdf; ComponentLink2Description: DigiKey Link; ComponentLink2URL: http://digikey.com/product-detail/en/panasonic-electronic-components/ERA-3AEB1652V/P16.5KDBCT-ND/3075821; Composition: Thin Film; Device Package: 0603 (1608 Metric); Features: Automotive AEC-Q200; Height - Seated (Max): 0.022" (0.55mm); LastUpdated: 21/01/2020 00:15:50; Lifecycle Status: Active; Minimum Order: 1; Number of Terminations: 2; Operating Temperature: -55°C ~ 155°C; Package / Case: 0603 (1608 Metric); Packaging: TapeAndReel; PartId: 24776; Part Status: Active; Price: 0.04; Ratings: AEC-Q200; Resistance: 16.5 kOhms; Series: ERA-3A; Size / Dimension: 0.063" L x 0.031" W (1.60mm x 0.80mm); Supplier 1: DigiKey; Supplier Part Number 1: P16.5KDBCT-ND; Supplier Device Package: 0603
R20 = CRCW060310K0JNEA: as R27 on sheet [4] USB-PD Controller; Part Number: CRCW060310K0JNEA; Value: 10 kOhms; ComponentLink1Description: Datasheet; ComponentLink1URL: http://www.vishay.com/docs/20035/dcrcwe3.pdf; ComponentLink2Description: DigiKey Link; ComponentLink2URL: http://digikey.com/product-detail/en/vishay-dale/CRCW060310K0JNEA/541-10KGCT-ND/1179393; Composition: Thick Film; Device Package: 0603 (1608 Metric); Features: Automotive AEC-Q200; Height - Seated (Max): 0.020" (0.50mm); LastUpdated: 21/01/2020 00:24:50; Lifecycle Status: Active; Minimum Order: 1; Number of Terminations: 2; Operating Temperature: -55°C ~ 155°C; Package / Case: 0603 (1608 Metric); Packaging: CutTape; PartId: 5216; Part Status: Active; Price: 0.10; Ratings: AEC-Q200; Resistance: 10 kOhms; Series: CRCW; Size / Dimension: 0.063" L x 0.033" W (1.60mm x 0.85mm); Supplier 1: DigiKey; Supplier Part Number 1: 541-10KGCT-ND; Supplier Device Package: 0603; Tolerance: ±5%
U2 = TI LM5176RHF: 55-V Wide VIN synchronous 4-switch buck-boost controller

## Sheet [6] Power Output.SchDoc: Current Sensing & Output
size A3; Author: Caner ALP; Organization: ALP Electronics; Address1: Axel Oxenstiernas; Address2: Västerås; Address3: 72478; Address4: Sweden; DocumentNumber: 6; SheetNumber: 6; SheetTotal: 7
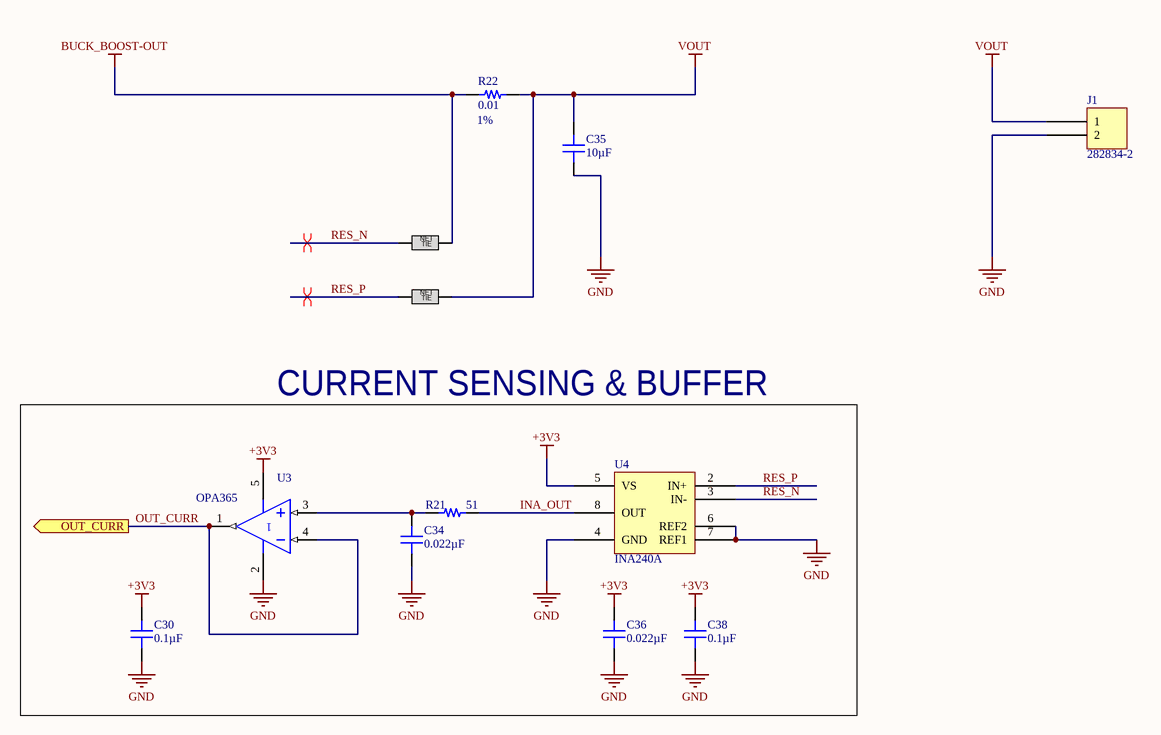
[diagram p6: [6] Power Output.SchDoc]

### Parts
C30  0.1µF  [CAP 0805_2012]
C34  0.022µF  [CAP 0603_1608]
C35  10µF  [CAP 2220_5650 2.5MM]
C36  0.022µF  [CAP 0603_1608]
C38  0.1µF  [CAP 0805_2012]
J1  282834-2  [TE 282834-2]
NetTie3  Net Tie  [Net_Tie_2x0.156mm]  (value not drawn)
NetTie4  Net Tie  [Net_Tie_2x0.156mm]  (value not drawn)
R21  51  [RES 0603/1608]
R22  0.01  Tolerance: 1%  [STACKPOLE CSR2512]
U3  OPA365  [DIODES SOT-23-5 W5]
U4  INA240A  [Atmel TSSOP-8 8X]

### Blocks framed on the sheet
CURRENT SENSING & BUFFER: C30 C34 C36 C38 R21 U3 U4

### Ports
OUT_CURR (out)

### Nets
+3V3: C30.2 C36.2 C38.2 U3.5(V-) U4.5(VS)
BUCK_BOOST-OUT: NetTie3.2 R22.1
GND: C30.1 C34.1 C35.1 C36.1 C38.1 J1.2 U3.2(V+) U4.4(GND) U4.6(REF2) U4.7(REF1)
VOUT: C35.2 J1.1 NetTie4.2 R22.2
INA_OUT: R21.2 U4.8(OUT)
OUT_CURR: U3.1(OUT) U3.4(IN-) ; port OUT_CURR
RES_N: NetTie3.1 U4.3(IN-)
RES_P: NetTie4.1 U4.2(IN+)
NetC34_2: C34.2 R21.1 U3.3(IN+)

Not connected (* = marked no-connect by the designer): U4 1(NC)

### Layout directives
differential pair: RES_N, RES_P

### Notes on the sheet
- Title
- Size:
- Project
- A3
- Revision:
- Date:
- Sheet
- of
- (in symbol Net Tie) NET; TIE

### Library data of the parts
C30 C38 = 160R15W104KV4T: CAP CER 0.1UF 16V X7R 0805; Manufacturer: Johanson Dielectrics Inc.; Tolerance: ±10%; Part Number: 160R15W104KV4T; Value: 0.1µF; Applications: General Purpose; Capacitance: 0.1µF; ComponentLink1Description: Datasheet; ComponentLink1URL: https://www.johansondielectrics.com/downloads/catalog/johanson-dielectrics-product-catalog.pdf; ComponentLink2Description: DigiKey Link; ComponentLink2URL: http://digikey.com/product-detail/en/johanson-dielectrics-inc/160R15W104KV4T/709-1183-1-ND/1859515; Device Package: 0805 (2012 Metric); LastUpdated: 21/01/2020 00:02:56; Lifecycle Status: Active; Minimum Order: 1; Mounting Type: Surface Mount, MLCC; Operating Temperature: -55°C ~ 125°C; Package / Case: 0805 (2012 Metric); Packaging: TapeAndReel; PartId: 9125; Part Status: Active; Price: 0.03; Series: -; Size / Dimension: 0.080" L x 0.050" W (2.03mm x 1.27mm); Supplier 1: DigiKey; Supplier Part Number 1: 709-1183-1-ND; Temperature Coefficient: X7R; Thickness (Max): 0.050" (1.27mm); Voltage - Rated: 16V
C34 C36 = 0603B223J250CT: CAP CER 0.022UF 25V X7R 0603; Manufacturer: Walsin Technology Corporation; Tolerance: ±5%; Part Number: 0603B223J250CT; Value: 0.022µF; Applications: General Purpose; Capacitance: 0.022µF; ComponentLink1Description: Datasheet; ComponentLink1URL: http://www.passivecomponent.com/wp-content/uploads/2018/10/MLCC.pdf; ComponentLink2Description: DigiKey Link; ComponentLink2URL: http://digikey.com/product-detail/en/walsin-technology-corporation/0603B223J250CT/1292-1413-1-ND/9355417; Device Package: 0603 (1608 Metric); LastUpdated: 21/01/2020 00:01:52; Lifecycle Status: Active; Minimum Order: 1; Mounting Type: Surface Mount, MLCC; Operating Temperature: -55°C ~ 125°C; Package / Case: 0603 (1608 Metric); Packaging: TapeAndReel; PartId: 13332; Part Status: Active; Price: 0.01; Series: -; Size / Dimension: 0.063" L x 0.031" W (1.60mm x 0.80mm); Supplier 1: DigiKey; Supplier Part Number 1: 1292-1413-1-ND; Temperature Coefficient: X7R; Thickness (Max): 0.034" (0.87mm); Voltage - Rated: 25V
C35 = C5750X7R1H106M230KB: as C11 on sheet [3] Power; Part Number: C5750X7R1H106M230KB; Value: 10µF; Applications: General Purpose; Capacitance: 10µF; ComponentLink1Description: Datasheet; ComponentLink1URL: https://product.tdk.com/info/en/catalog/datasheets/mlcc_commercial_general_en.pdf?ref_disty=digikey; ComponentLink2Description: DigiKey Link; ComponentLink2URL: http://digikey.com/product-detail/en/tdk-corporation/C5750X7R1H106M230KB/445-1454-1-ND/569120; Device Package: 2220 (5750 Metric); LastUpdated: 21/01/2020 00:34:55; Lifecycle Status: Active; Minimum Order: 1; Mounting Type: Surface Mount, MLCC; Operating Temperature: -55°C ~ 125°C; Package / Case: 2220 (5750 Metric); Packaging: TapeAndReel; Part Status: Active; Price: 0.85; Series: C; Size / Dimension: 0.224" L x 0.197" W (5.70mm x 5.00mm); Supplier 1: DigiKey; Supplier Part Number 1: 445-1454-1-ND; Temperature Coefficient: X7R; Thickness (Max): 0.098" (2.50mm); Voltage - Rated: 50V
J1 = 282834-2: as J3 on sheet [4] USB-PD Controller; Part Number: 282834-2; Color: Green; ComponentLink1Description: Datasheet; ComponentLink1URL: https://www.te.com/commerce/DocumentDelivery/DDEController?Action=srchrtrv&DocNm=282834&DocType=Customer+Drawing&DocLang=English; ComponentLink2Description: DigiKey Link; ComponentLink2URL: http://digikey.com/product-detail/en/te-connectivity-amp-connectors/282834-2/A98333-ND/1150135; LastUpdated: 15/01/2020 04:15:38; Lifecycle Status: Active; Minimum Order: 1; Mounting Type: Through Hole; Packaging: Bulk; Part Status: Active; Price: 0.88; Series: Buchanan; Supplier 1: DigiKey; Supplier Part Number 1: A98333-ND
R21 = ERJ-3EKF51R0V: RES SMD 51 OHM 1% 1/10W 0603; Manufacturer: Panasonic Electronic Components; TemperatureRange: -55C ~ 155C; TemperatureCoefficient: 100ppm/C; PowerRating: 0.1W, 1/10W; Value: 51; Part Number: ERJ-3EKF51R0V; PartId: 1355; Supplier 1: Digi-Key; Supplier Part Number 1: P51.0HTR-ND; ComponentLink1Description: Datasheet; ComponentLink1URL: http://industrial.panasonic.com/www-cgi/jvcr13pz.cgi?E+PZ+3+AOA0002+ERJ3EKF51R0V+7+WW; ComponentLink2Description: Digi-Key listing; ComponentLink2URL: http://digikey.com/product-detail/en/ERJ-3EKF51R0V/P51.0HTR-ND/1746433; Tolerance: 1%; Price: 0,0038; Type: Thick Film; Device Package: 0603 (1608 Metric)
R22 = CSR2512FK10L0: as R16 on sheet [3] Power; Value: 0.01; Part Number: CSR2512FK10L0; PartId: 10090; Supplier 1: Digi-Key; Supplier Part Number 1: CSR2512FK10L0-ND; ComponentLink1Description: Datasheet; ComponentLink1URL: http://www.seielect.com/catalog/SEI-CSR_CSRN.pdf; ComponentLink2Description: Digi-Key Listing; ComponentLink2URL: https://www.digikey.com/product-detail/en/stackpole-electronics-inc/CSR2512FK10L0/CSR2512FK10L0-ND/1742503; PowerRating: 2W; Price: 0.22; Device Package: 2512 (6432 Metric)
U3 = 9691: RAIL-TO-RAIL OPAMP SOT-23-5; Published: 15-Apr-2002; LatestRevisionDate: 04-Mar-2005; LatestRevisionNote: Stylized 3D Model Added.; DatasheetVersion: Jan-1989; PackageVersion: Jun-1999; PackageReference: J014; Publisher: Altium Limited; PackageDescription: DIP; 14 Leads; Row Spacing 7.62 mm; Pitch 2.54 mm; ComponentLink1Description: Manufacturer Link; ComponentLink1URL: http://www.ti.com/; ComponentLink2Description: Datasheet; ComponentLink2URL: http://www-s.ti.com/sc/ds/lm224.pdf; PartId: 9691; Part Number: TSV911ILT
U4 = 9694: IC AMP CURRENT SENSE 8-TSSOP; PartId: 9694; Part Number: INA240A

## Nets that join several sheets
+3V3: [2] MCU (15 pins), [5] USB-C Connector (7 pins), [7] Display (5 pins), [4] USB-PD Controller (5 pins), [3] Power (R20.1), [6] Power Output (5 pins)
BUCK_BOOST-OUT: [3] Power (7 pins), [6] Power Output (NetTie3.2 R22.1)
GND: [2] MCU (23 pins), [5] USB-C Connector (18 pins), [7] Display (7 pins), [4] USB-PD Controller (17 pins), [3] Power (23 pins), [6] Power Output (10 pins)
PP_HV_SINK: [5] USB-C Connector (P4.1), [4] USB-PD Controller (5 pins), [3] Power (9 pins)
VBUS_SINK: [5] USB-C Connector (5 pins), [4] USB-PD Controller (C55.2 U6.3-4 U6.13-14)
VOUT: [3] Power (R17.2 U2.9), [6] Power Output (C35.2 J1.1 NetTie4.2 R22.2)
5V_PB_SINK: [2] MCU (U1.62), [4] USB-PD Controller (U6.40)
9V_PB_SINK: [2] MCU (U1.63), [4] USB-PD Controller (U6.41)
15V_PB_SINK: [2] MCU (U1.64), [4] USB-PD Controller (U6.42)
20V_PB_SINK: [2] MCU (U1.6), [4] USB-PD Controller (U6.43)
CC1: [5] USB-C Connector (U5.12), [4] USB-PD Controller (C59.2 U6.24)
CC2: [5] USB-C Connector (U5.11), [4] USB-PD Controller (C58.2 U6.26)
CUR_DAC_OUT: [2] MCU (U1.3), [3] Power (R14.2)
ENC_A: [2] MCU (U1.31), [7] Display (E1.A R32.1)
ENC_B: [2] MCU (U1.32), [7] Display (E1.B R33.1)
ENC_SW: [2] MCU (U1.38), [7] Display (C64.1 E1.S1)
FB_DAC_OUT: [2] MCU (U1.14), [3] Power (R19.2)
LCD_BLK: [2] MCU (U1.26), [7] Display (LCD1.7)
LCD_DC: [2] MCU (U1.27), [7] Display (LCD1.6)
LCD_RST: [2] MCU (U1.28), [7] Display (LCD1.5)
LCD_SPICLK: [2] MCU (U1.30), [7] Display (LCD1.3)
LCD_SPIMOSI: [2] MCU (U1.29), [7] Display (LCD1.4)
OUT_CURR: [2] MCU (U1.5), [6] Power Output (U3.1 U3.4)
PD_RESET: [2] MCU (U1.60), [4] USB-PD Controller (U6.44)
PM_EN: [2] MCU (U1.37), [3] Power (U2.26)
PP_EXT1: [2] MCU (U1.9), [4] USB-PD Controller (U6.48)
PP_EXT2: [2] MCU (U1.10), [4] USB-PD Controller (U6.49)
SPI_CLK: [2] MCU (U1.36), [4] USB-PD Controller (U6.38)
SPI_MISO: [2] MCU (U1.49), [4] USB-PD Controller (U6.36)
SPI_MOSI: [2] MCU (U1.50), [4] USB-PD Controller (U6.37)
SPI_SS: [2] MCU (U1.35), [4] USB-PD Controller (U6.39)
USB_N: [2] MCU (U1.45), [5] USB-C Connector (J2.A7 J2.B7 U5.20), [4] USB-PD Controller (U6.53)
USB_P: [2] MCU (U1.46), [5] USB-C Connector (J2.A6 J2.B6 U5.19), [4] USB-PD Controller (U6.50)